# Altium schematic sheet Fetch Execution Counter Electronic Sheme_2021-10-10.schdoc
size 264 x 176 mm
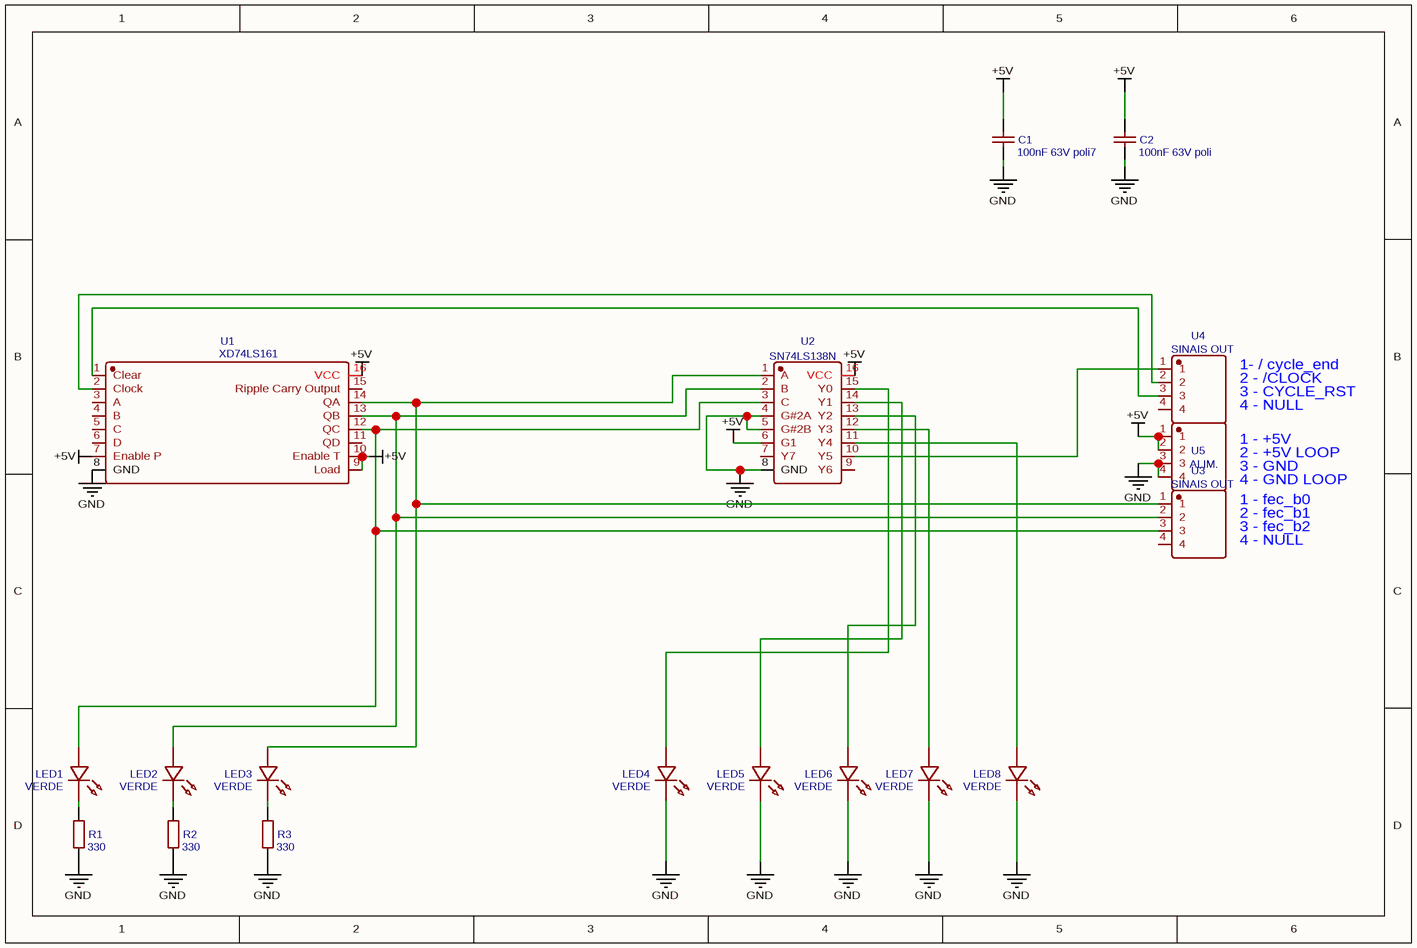
[diagram p0: Fetch Execution Counter Electronic Sheme_2021-10-10.schdoc]

## Parts
C1  100nF 63V poli7  [CAP-TH_L7.6-W3.8-P5.08-D0.51]
C2  100nF 63V poli  [CAP-TH_L7.6-W3.8-P5.08-D0.51]
LED1  VERDE  [LED-TH_BD3.0-P2.54-RD-GREEN]
LED2  VERDE  [LED-TH_BD3.0-P2.54-RD-GREEN]
LED3  VERDE  [LED-TH_BD3.0-P2.54-RD-GREEN]
LED4  VERDE  [LED-TH_BD3.0-P2.54-RD-GREEN]
LED5  VERDE  [LED-TH_BD3.0-P2.54-RD-GREEN]
LED6  VERDE  [LED-TH_BD3.0-P2.54-RD-GREEN]
LED7  VERDE  [LED-TH_BD3.0-P2.54-RD-GREEN]
LED8  VERDE  [LED-TH_BD3.0-P2.54-RD-GREEN]
R1  330  [RES-TH_BD3.0-L9.5-P13.50-D0.6]
R2  330  [RES-TH_BD3.0-L9.5-P13.50-D0.6]
R3  330  [RES-TH_BD3.0-L9.5-P13.50-D0.6]
U1  XD74LS161  [DIP-16_L19.2-W6.6-P2.54-LS7.6-BL]
U2  SN74LS138N  [DIP-16_L19.8-W6.5-P2.54-LS7.6-BL]
U3  SINAIS OUT  [HDR-TH_4P-P2.54-D1.0]
U4  SINAIS OUT  [HDR-TH_4P-P2.54-D1.0]
U5  ALIM.  [HDR-TH_4P-P2.54-D1.0]

## Nets
+5V: C1.1 C2.1 U1.7(Enable_P) U1.9(Load) U1.10(Enable_T) U1.16(VCC) U2.6(G1) U2.16(VCC) U5.1 U5.2
GND: C1.2 C2.2 LED4.1(-) LED5.1(-) LED6.1(-) LED7.1(-) LED8.1(-) R1.2 R2.2 R3.2 U1.8(GND) U2.4(G#2A) U2.5(G#2B) U2.8(GND) U5.3 U5.4
NetLED1_1: LED1.1(-) R1.1
NetLED1_2: LED1.2(+) U1.12(QC) U2.3(C) U3.3
NetLED2_1: LED2.1(-) R2.1
NetLED2_2: LED2.2(+) U1.13(QB) U2.2(B) U3.2
NetLED3_1: LED3.1(-) R3.1
NetLED3_2: LED3.2(+) U1.14(QA) U2.1(A) U3.1
NetLED4_2: LED4.2(+) U2.15(Y0)
NetLED5_2: LED5.2(+) U2.14(Y1)
NetLED6_2: LED6.2(+) U2.13(Y2)
NetLED7_2: LED7.2(+) U2.12(Y3)
NetLED8_2: LED8.2(+) U2.11(Y4)
NetU1_1: U1.1(Clear) U4.3
NetU1_2: U1.2(Clock) U4.2
NetU2_10: U2.10(Y5) U4.1

Not connected (* = marked no-connect by the designer): U1 3(A) 4(B) 5(C) 6(D) 11(QD) 15(Ripple_Carry_Output); U2 7(Y7) 9(Y6); U3 4; U4 4

## Notes on the sheet
- 2 - /CLOCK
- 3 - CYCLE_RST
- 4 - NULL
- 1- / cycle_end
- 1 - +5V
- 3 - GND
- 4 - GND LOOP
- 2 - +5V LOOP
- 1 - fec_b0
- 3 - fec_b2
- 2 - fec_b1

## Library data of the parts
C1 = 100nF 63V poli7: BOM_Manufacturer: AVX; BOM_Manufacturer Part: SR305C105KAR; nameAlias: Capacitance; Contributor: LCSC; BOM_Supplier: LCSC; BOM_Supplier Part: C444741; BOM_JLCPCB Part Class: Extended Part; spicePre: C; spiceSymbolName: SR305C105KAR
C2 = 100nF 63V poli: BOM_Manufacturer: AVX; BOM_Manufacturer Part: SR305C105KAR; nameAlias: Capacitance; Contributor: LCSC; BOM_Supplier: LCSC; BOM_Supplier Part: C444741; BOM_JLCPCB Part Class: Extended Part; spicePre: C; spiceSymbolName: SR305C105KAR
LED1-LED8 = VERDE: BOM_Manufacturer: Everlight Elec; BOM_Manufacturer Part: 264-7GD; Contributor: LCSC; BOM_Supplier: LCSC; BOM_Supplier Part: C605465; BOM_JLCPCB Part Class: Extended Part; spicePre: L; spiceSymbolName: 264-7GD
R1-R3 = 330: BOM_Manufacturer Part: CFR02SJ0823A10; BOM_Manufacturer: UniOhm; nameAlias: Resistance (Ohms); BOM_Supplier: LCSC; BOM_Supplier Part: C69876; spicePre: R; spiceSymbolName: CFR02SJ0823A10
U1 = XD74LS161: BOM_Manufacturer: XINLUDA; Contributor: LCSC; BOM_Supplier: LCSC; BOM_Supplier Part: C609766; BOM_Manufacturer Part: XD74LS161; BOM_JLCPCB Part Class: Extended Part; spicePre: U; spiceSymbolName: XD74LS161
U2 = SN74LS138N: BOM_Manufacturer: Texas Instruments; Contributor: LCSC; BOM_Supplier: LCSC; BOM_Supplier Part: C352964; BOM_Manufacturer Part: SN74LS138N; BOM_JLCPCB Part Class: Extended Part; spicePre: U; spiceSymbolName: SN74LS138N
U3 U4 = SINAIS OUT: BOM_Manufacturer: TE Connectivity; BOM_Manufacturer Part: 171825-4; Contributor: LCSC; BOM_Supplier: LCSC; BOM_Supplier Part: C210162; BOM_JLCPCB Part Class: Extended Part; spicePre: U; spiceSymbolName: 171825-4
U5 = ALIM.: BOM_Manufacturer: TE Connectivity; BOM_Manufacturer Part: 171825-4; Contributor: LCSC; BOM_Supplier: LCSC; BOM_Supplier Part: C210162; BOM_JLCPCB Part Class: Extended Part; spicePre: U; spiceSymbolName: 171825-4